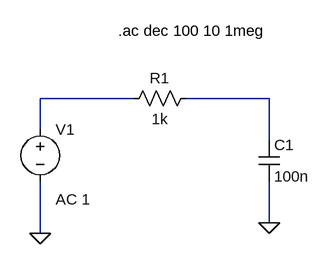
[diagram p0: schematic Draft3.asc]
Draft3.asc, the LTspice schematic file:
Version 4
SHEET 1 880 680
WIRE 208 96 64 96
WIRE 416 96 288 96
WIRE 64 144 64 96
WIRE 416 160 416 96
WIRE 416 288 416 224
WIRE 64 304 64 224
FLAG 416 288 0
FLAG 64 304 0
SYMBOL voltage 64 128 R0
WINDOW 123 24 124 Left 2
WINDOW 39 0 0 Left 0
SYMATTR InstName V1
SYMATTR Value ""
SYMATTR Value2 AC 1
SYMBOL cap 400 160 R0
SYMATTR InstName C1
SYMATTR Value 100n
SYMBOL res 304 80 R90
WINDOW 0 0 56 VBottom 2
WINDOW 3 32 56 VTop 2
SYMATTR InstName R1
SYMATTR Value 1k
TEXT 184 -8 Left 2 !.ac dec 100 10 1meg

The netlist it stands for:
* Draft3.asc
V1 N001 0 AC 1
C1 N002 0 100n
R1 N002 N001 1k
.ac dec 100 10 1meg
.backanno
.end